# Altium schematic sheet Output.SchDoc
size 420 x 297 mm; SheetNumber: 5; SheetTotal: 6
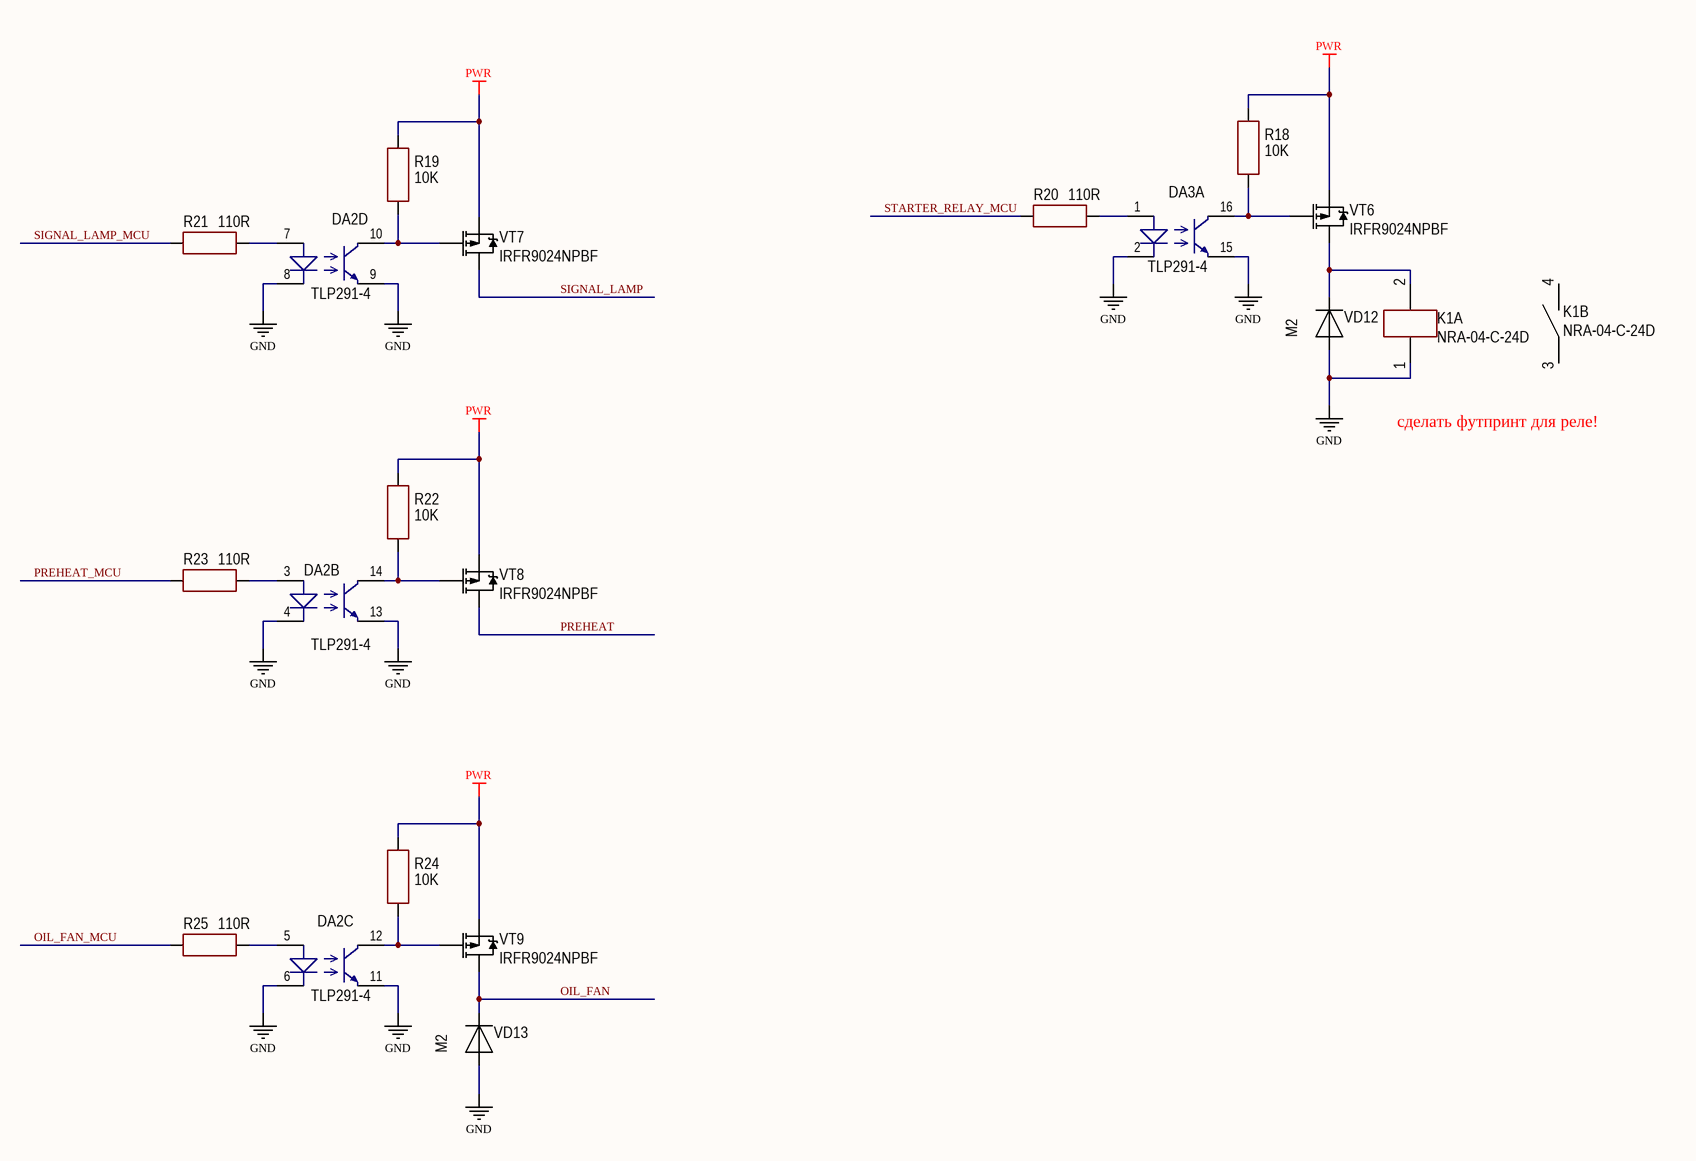
[diagram p0: Output.SchDoc]

## Parts
DA2  TLP291-4  [SOP16]  (parts B,C,D of 4)
DA3  TLP291-4  [SOP16]  (part A of 4)
K1  PartNumber: NRA-04-C-24D  [REL: T9GS1]  (parts A,B of 2)
R18  value 10K  [RES: 1206]
R19  value 10K  [RES: 1206]
R20  value 110R  [RES: 1206]
R21  value 110R  [RES: 1206]
R22  value 10K  [RES: 1206]
R23  value 110R  [RES: 1206]
R24  value 10K  [RES: 1206]
R25  value 110R  [RES: 1206]
VD12  PartNumber: M2  [DIODE: SMA]
VD13  PartNumber: M2  [DIODE: SMA]
VT6  PartNumber: IRFR9024NPBF  [DPAK]
VT7  PartNumber: IRFR9024NPBF  [DPAK]
VT8  PartNumber: IRFR9024NPBF  [DPAK]
VT9  PartNumber: IRFR9024NPBF  [DPAK]

## Nets
GND: DA2.4 DA2.6 DA2.8 DA2.9 DA2.11 DA2.13 DA3.2 DA3.15 K1.1 VD12.1 VD13.1
PWR: R18.2 R19.2 R22.2 R24.2 VT6.3(S) VT7.3(S) VT8.3(S) VT9.3(S)
OIL_FAN: VD13.2 VT9.2(D)
OIL_FAN_MCU: R25.2
PREHEAT: VT8.2(D)
PREHEAT_MCU: R23.2
SIGNAL_LAMP: VT7.2(D)
SIGNAL_LAMP_MCU: R21.2
STARTER_RELAY_MCU: R20.2
NetDA2_3: DA2.3 R23.1
NetDA2_5: DA2.5 R25.1
NetDA2_7: DA2.7 R21.1
NetDA2_10: DA2.10 R19.1 VT7.1(G)
NetDA2_12: DA2.12 R24.1 VT9.1(G)
NetDA2_14: DA2.14 R22.1 VT8.1(G)
NetDA3_1: DA3.1 R20.1
NetDA3_16: DA3.16 R18.1 VT6.1(G)
NetK1_2: K1.2 VD12.2 VT6.2(D)

Not connected (* = marked no-connect by the designer): K1 3 4

## Notes on the sheet
- сделать футпринт для реле!
- Подп. и дата
- Инв. № дубл.
- Взам. инв. №
- Инв. № подл.
- Изм.
- Лист
- № докум.
- Подп.
- Дата
- 2.106-A3
- Копировал
- Формат А3

## Library data of the parts
K1 = Relay_T9GS1L14: Manufacturer: TE Connectivity; ValueManufacturerPartNumber: Electromechanics relay, 12VDC, 480VAC, 30A, 1NO, -40...+85°C; TypeRelay: Electromechanics relay; VoltageMax: 480VAC; VoltageControlCoil: 12VDC; MaxCurrent: 30A; Package: 1NO; HelpURL: https://www.digikey.com/products/en?keywords=T9GS1L14-12; Temperature: -40...+85°C
R18 R19 R22 R24 = Resistor_1206: Manufacturer: Yageo; PartNumber: RC1206JR-07100RL; ValueManufacturerPartNumber: Resistor film, 10K, ±5%, 1206, 0.25W, -55...+125°C; TypeResistor: Resistor film; Power: 0.25W; Tolerance: ±5%; Package: 1206; HelpURL: https://www.digikey.com/product-detail/en/yageo/RC1206JR-07100RL/311-100ERCT-ND/732153; Temperature: -55...+125°C
R20 R21 R23 R25 = Resistor_1206: Manufacturer: Yageo; PartNumber: RC1206JR-07100RL; ValueManufacturerPartNumber: Resistor film, 110R, ±5%, 1206, 0.25W, -55...+125°C; TypeResistor: Resistor film; Power: 0.25W; Tolerance: ±5%; Package: 1206; HelpURL: https://www.digikey.com/product-detail/en/yageo/RC1206JR-07100RL/311-100ERCT-ND/732153; Temperature: -55...+125°C
VD12 VD13 = Diode_single: Manufacturer: Micro Commercial; ValueManufacturerPartNumber: Single diode, 75V, 150mA, 1V, 4ns, SOD-323, -55...+150°C; TypeDiode: Single diode; Voltage: 75V; Current: 150mA; VoltageDrop: 1V; RecoveryTime: 4ns; Package: SOD-323; HelpURL: https://www.digikey.com/product-detail/en/micro-commercial-co/1N4148WX-TP/1N4148WXTPMSCT-ND/717312; Temperature: -55...+150°C
VT6-VT9 = MOSFET_P_123: Manufacturer: Infineon Technologies; ValueManufacturerPartNumber: MOSFET P-channel transistor, 20V, 2.6A, 2.9nC, 2.5W, 135mOhm, 220pF, SOT-23, -55...+150°C; TypeTransistor: MOSFET P-channel transistor; VoltageDS: 20V; CurrentDS: 2.6A; RDS: 135mOhm; GateCharge: 2.9nC; InputCapacitor: 220pF; MaxPower: 2.5W; Package: SOT-23; HelpURL: https://www.digikey.com/product-detail/en/infineon-technologies/IRLML2246TRPBF/IRLML2246TRPBFCT-ND/2639576; Temperature: -55...+150°C
DA2 DA3 = TLP291-4: Value: TLP291-4